# EAGLE board GaN_Fet_ESC_V0.1 (EAGLE 9.6.0), part 1 of 2
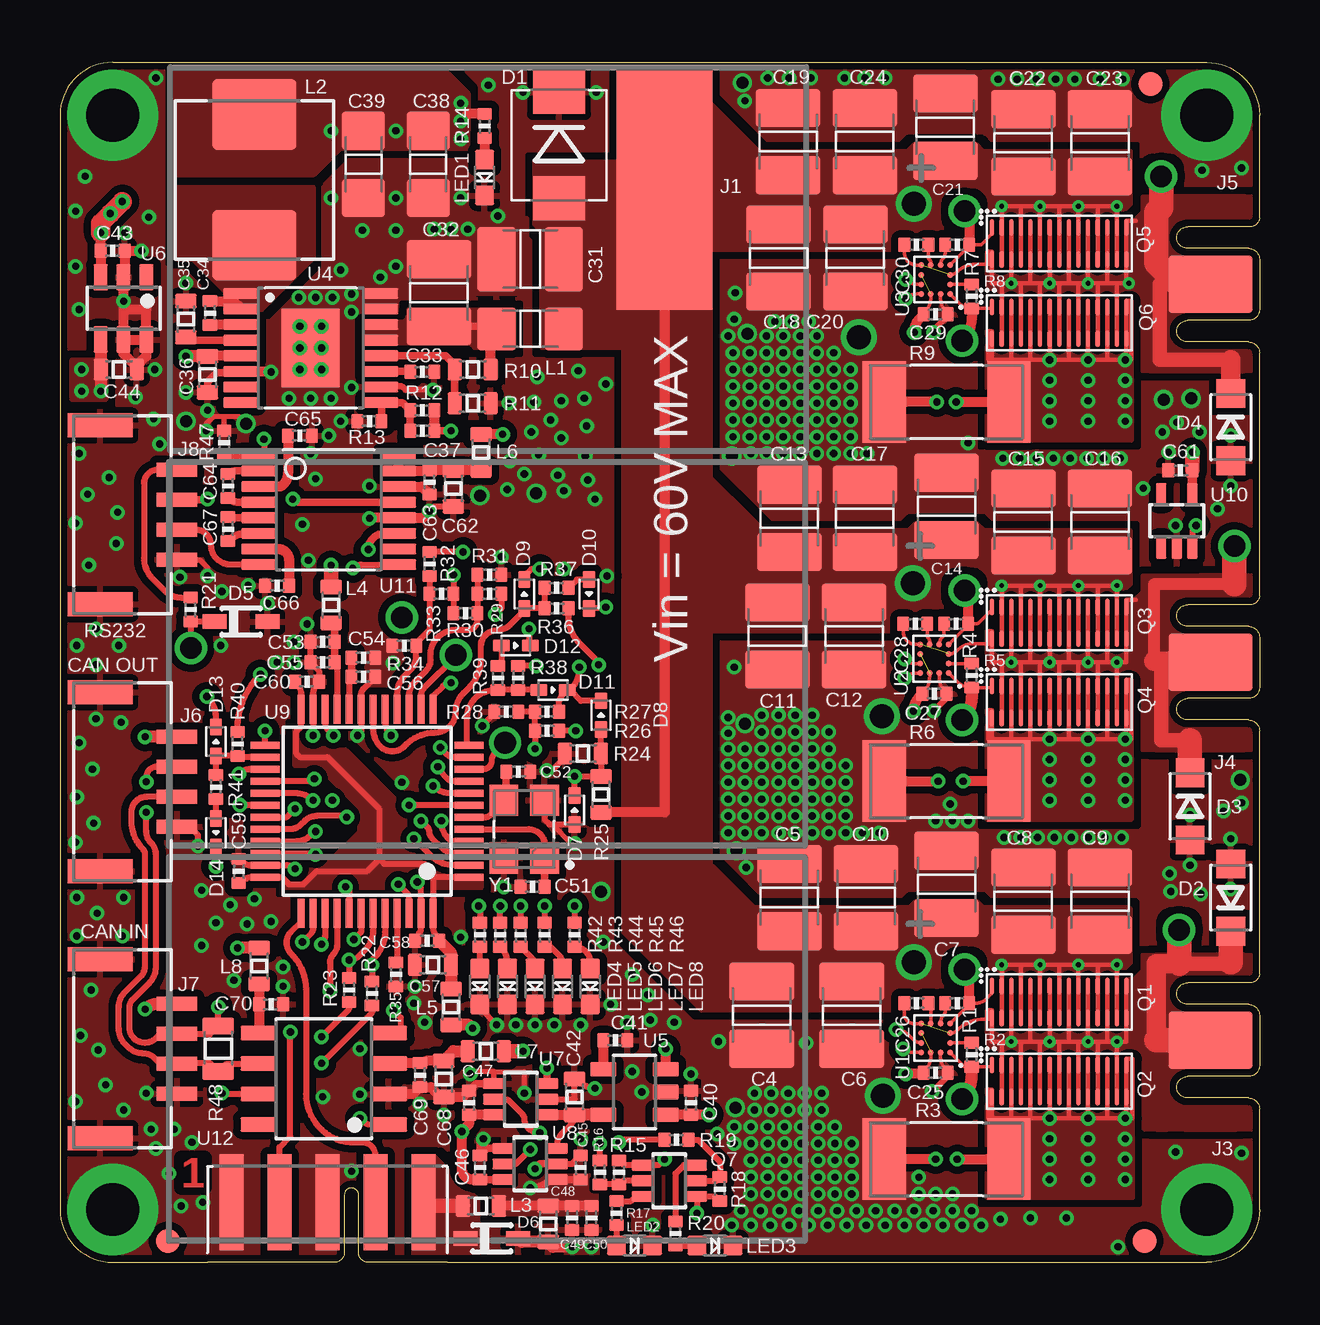
[diagram p2: board, top side]
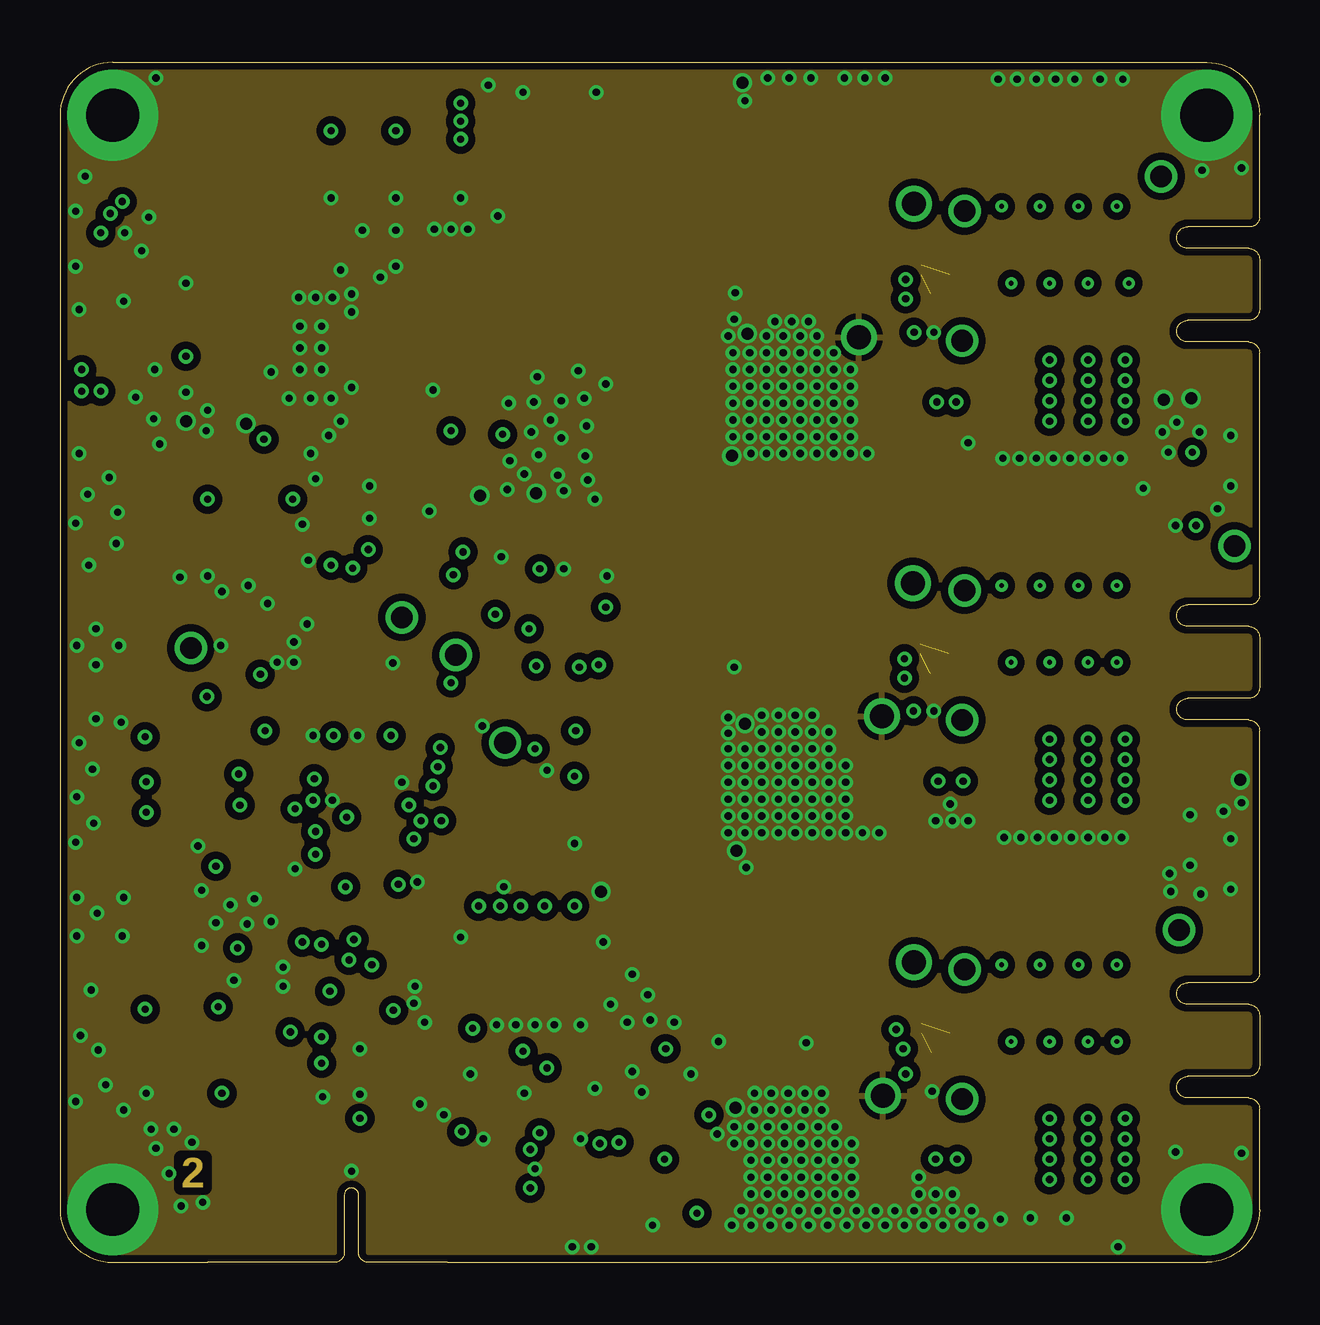
[diagram p3: board, inner layer Route2]
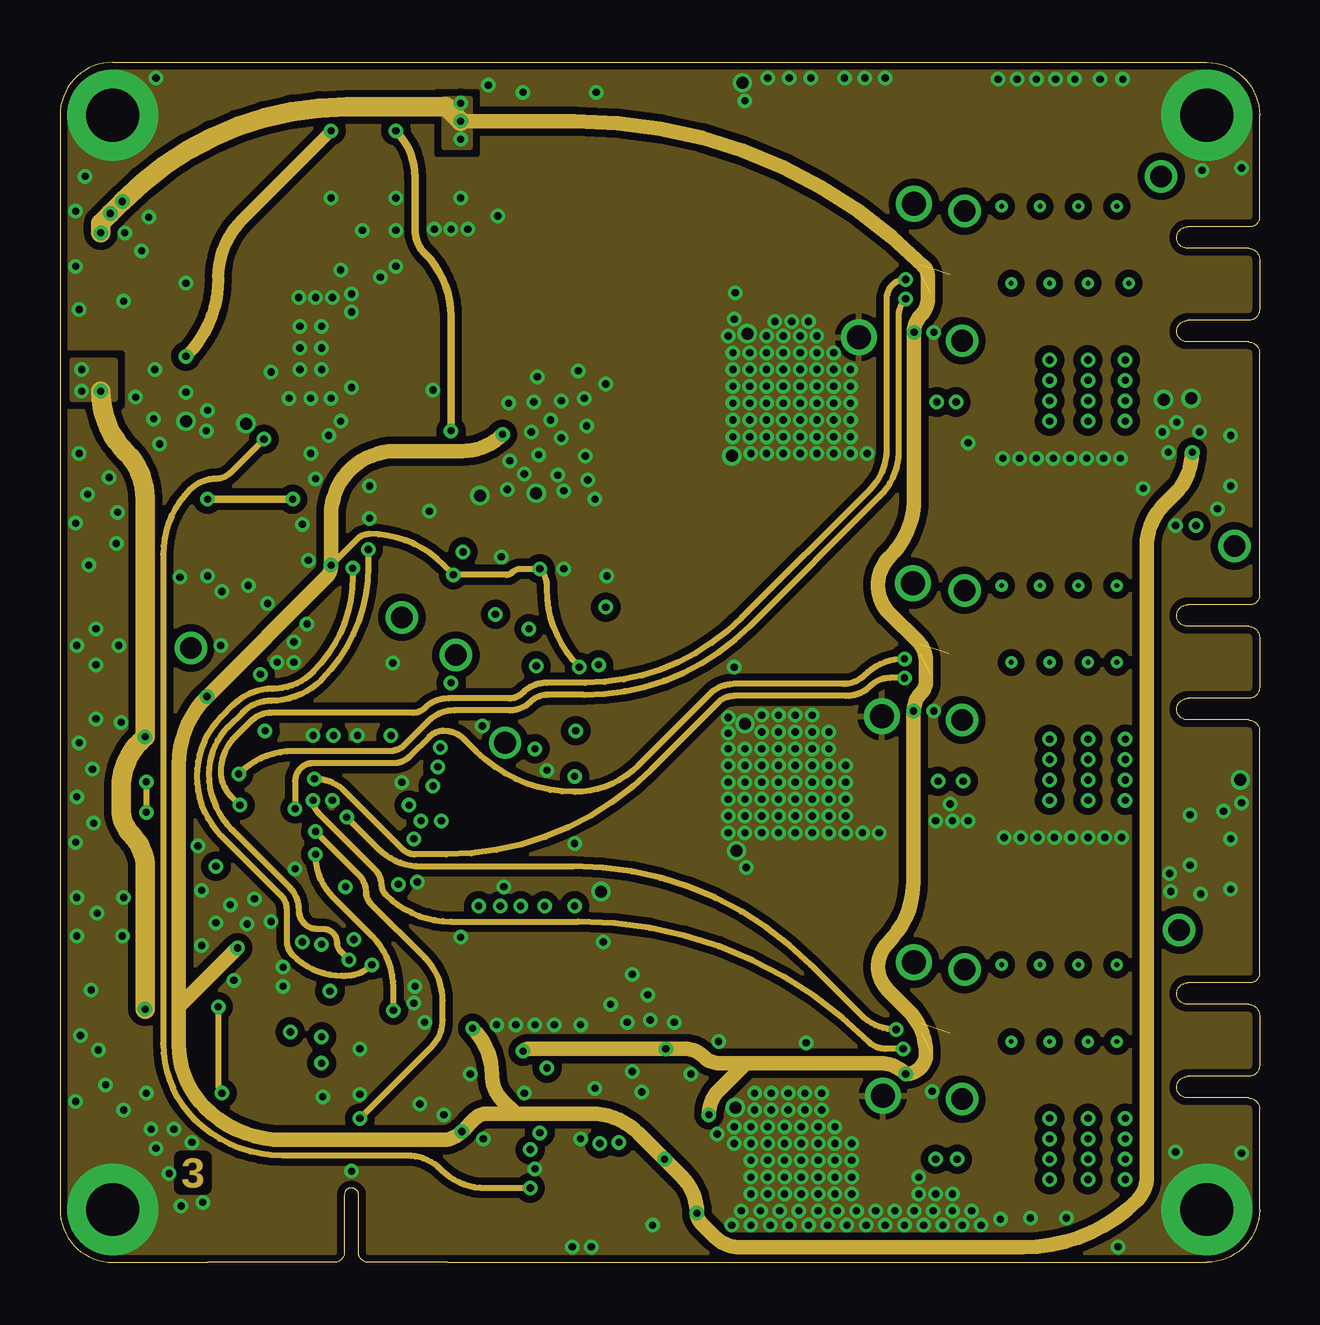
[diagram p4: board, inner layer Route15]
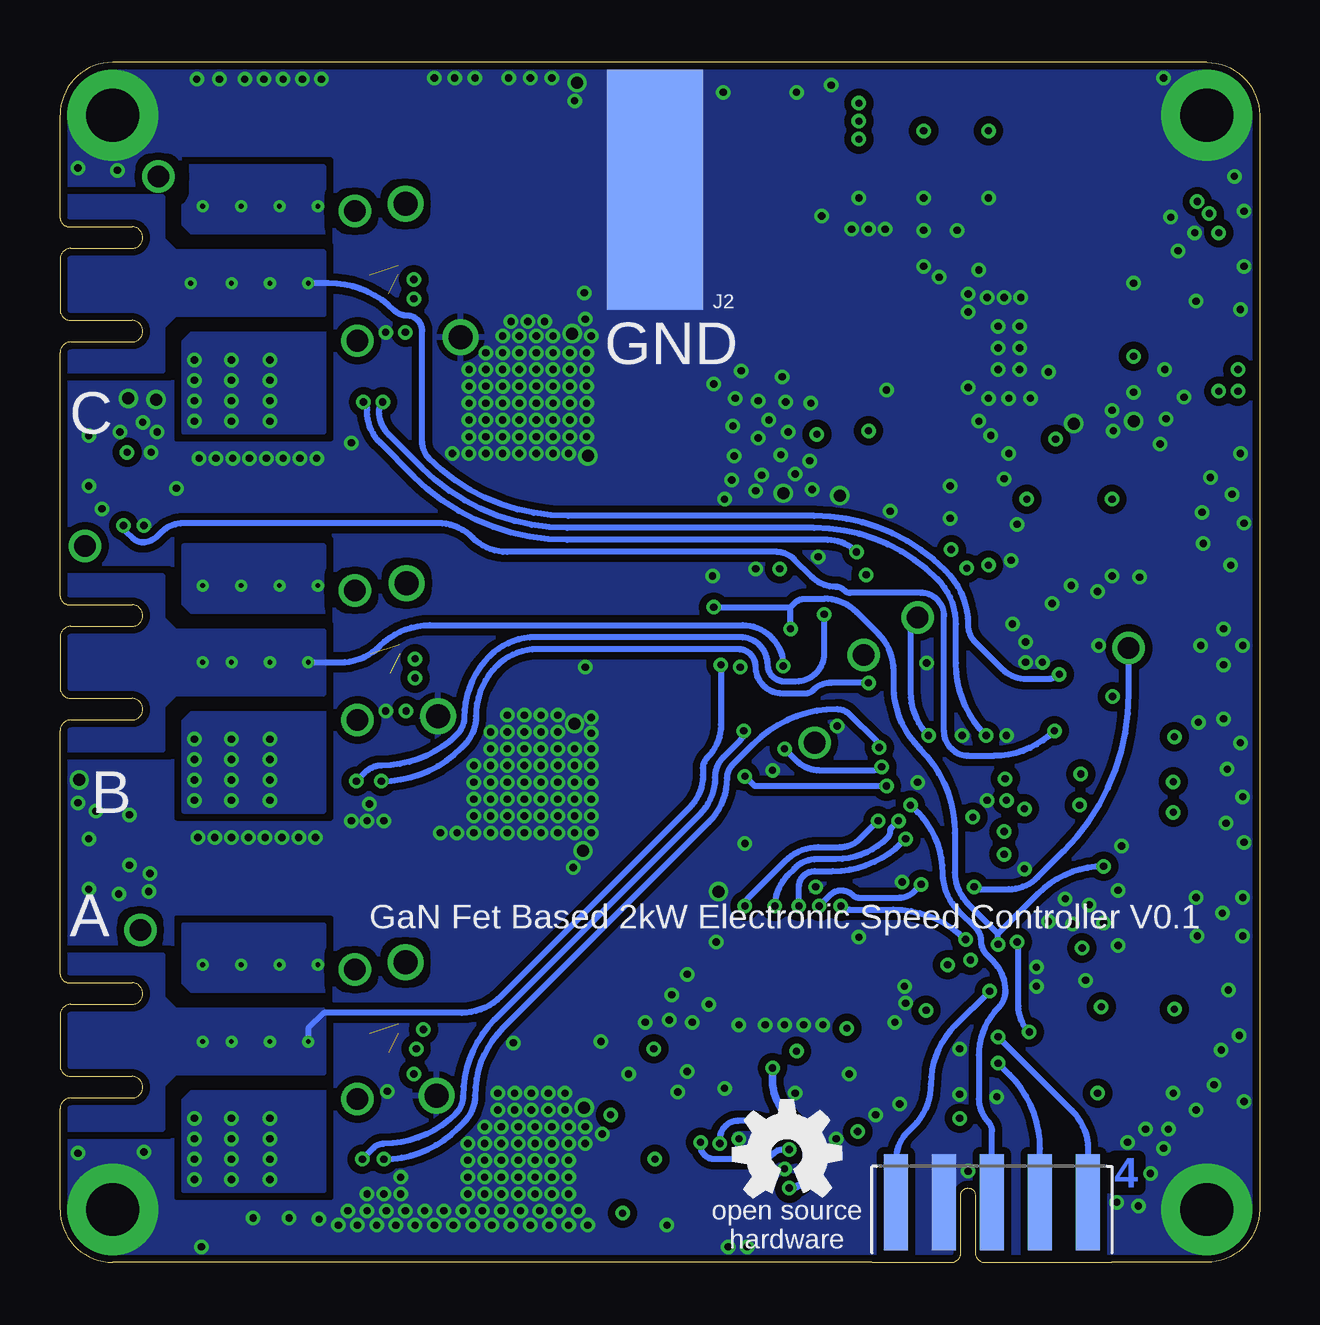
[diagram p5: board, bottom side, seen from below]

Size 50 x 50 mm. Coordinates in mm from the lower left corner, seen from the top.
Outline: 6.15,0 2.2,0 arc-90 0,2.2 0,47.8 arc-90 2.2,50 47.8,50 arc-90 50,47.8 50,43.5
Outline: 16.15,0 47.8,0 arc90 50,2.2 50,6.4
Outline: 50,12 50,22.15
Outline: 50,27.75 50,37.9
Copper layers (1+2*15+16): Top 0.035mm / dielectric 0.3mm / Route2 0.035mm / dielectric 0.15mm / Route15 0.035mm / dielectric 0.3mm / Bottom 0.035mm
Design rules "Design_Rules_10_mils_4_layer": minimum track width 5mil, minimum drill 0.25mm, track to track 5mil, track to pad 0.2mm, pad to pad 0.2mm, via to via 0.18mm, smd to smd 0.2mm, copper to edge 0.3mm, drill to drill 12mil, minimum pad ring 6mil, minimum via ring 6mil, stop-mask expansion 0mil, vias tented up to drill 0.6mm, thermal gap 10mil

## Footprints (pad centres in the part's own frame; a part is rotated, then mirrored left to right if it is on the bottom)
AIM_1_MM = smd 1 x 1: AIM 0,0
C_7.50_16_26.5_1 = drill 1: + -2.5,-2.3; - -0.2,3.25
C_7.50_16_26.5_2 = drill 1: + -2.5,-2.95; - -1.2,2.6
C_7.50_16_26.5_3 = drill 1: + -2.55,-3.6; - -1.25,1.95
C1210 = smd 1.6 x 2.7: 1 -1.4,0; 2 1.4,0
C0402 = smd 0.5 x 0.6: 1 -0.5,0; 2 0.5,0
C0603 = smd 0.6 x 0.9: 1 -0.75,0; 2 0.75,0
C1206 = smd 1.6 x 1.8: 1 -1.4,0; 2 1.4,0
DO214AA(SMB) = smd 1.82 x 2.18: A 2.21,0; K -2.21,0
SOD123F = smd 1.2 x 1.2: A 1.4,0; C -1.4,0
SOD323F = smd 1 x 0.6: A 1.1,0; C -1.1,0
SOD523 = smd 0.7 x 0.5: A 0.6,0; C -0.6,0
4X10SMD = smd 4 x 10: 1 0,0
POLYMAX_3.5MM = smd 3.5 x 2.4: 1 0,0
JST_SM04B-GHS-TB = smd 0.6 x 1.7: 1 -1.875,2.275; 2 -0.625,2.275; 3 0.625,2.275; 4 1.875,2.275 | smd 1 x 2.7: 5 -3.725,-0.925; 6 3.725,-0.925
009159010061916 = smd 1 x 4: 1 -4,-2.5; 2 -2,-2.5; 3 0,-2.5; 4 2,-2.5; 5 4,-2.5 | smd 1 x 4 bottom: 6 -4,-2.5; 7 -2,-2.5; 8 0,-2.5; 9 2,-2.5; 10 4,-2.5
L1206 = smd 1.6 x 1.8: 1 -1.4,0; 2 1.4,0
WURTH_6.6X6.6 = smd 2.95 x 3.5: 1 -2.725,0; 2 2.725,0
L0603 = smd 0.6 x 0.9: 1 -0.75,0; 2 0.75,0
CHIP-LED0603 = smd 0.8 x 0.8: A 0,-0.75; C 0,0.75
EPC2206 = smd 0.18 x 0.7: 1 -2.8,0.665; 2 -2.8,-0.665; 3 -2.4,0.665; 4 -2.4,-0.665; 5 -2,0.665; 6 -2,-0.665; 7 -1.6,0.665; 8 -1.6,-0.665; 9 -1.2,0.665; 10 -1.2,-0.665; 11 -0.8,0.665; 12 -0.8,-0.665; 13 -0.4,0.665; 14 -0.4,-0.665; 15 0,0.665; 16 0,-0.665; 17 0.4,0.665; 18 0.4,-0.665; 19 0.8,0.665; 20 0.8,-0.665; 21 1.2,0.665; 22 1.2,-0.665; 23 1.6,0.665; 24 1.6,-0.665; 25 2,0.665; 26 2,-0.665; 27 2.4,0.665; 28 2.4,-0.665; 29 2.8,0.665; 30 2.8,-0.665
SC-70-6 = smd 0.45 x 0.95: 1 0.65,1.1; 2 0,1.1; 3 -0.65,1.1; 4 -0.65,-1.1; 5 0,-1.1; 6 0.65,-1.1
R0402 = smd 0.5 x 0.6: 1 -0.5,0; 2 0.5,0
CSS2H-2512 = smd 1.8 x 3.4: 1 -2.6,0; 2 2.6,0 | smd 0 x 0: 1_SENSE -1.7,0; 2_SENSE 1.7,0
R0603 = smd 0.6 x 0.9: 1 -0.75,0; 2 0.75,0
R0805 = smd 0.7 x 1.3: 1 -0.95,0; 2 0.95,0
0.9MM = drill 0.9: P$1 0,0
0.5MM = drill 0.5: P$1 0,0
LMG1205 = smd 0.24 x 0.24: 1A -0.6,-0.6; 1B -0.2,-0.6; 1C 0.2,-0.6; 1D 0.6,-0.6; 2A -0.6,-0.2; 2D 0.6,-0.2; 3A -0.6,0.2; 3D 0.6,0.2; 4A -0.6,0.6; 4B -0.2,0.6; 4C 0.2,0.6; 4D 0.6,0.6
TSS0P16-PAD = smd 0.45 x 1.5: 1 -2.275,-2.9; 2 -1.625,-2.9; 3 -0.975,-2.9; 4 -0.325,-2.9; 5 0.325,-2.9; 6 0.975,-2.9; 7 1.625,-2.9; 8 2.275,-2.9; 9 2.275,2.9; 10 1.625,2.9; 11 0.975,2.9; 12 0.325,2.9; 13 -0.325,2.9; 14 -0.975,2.9; 15 -1.625,2.9; 16 -2.275,2.9 | smd 3.29 x 2.41: PAD 0,0
SOT-23-5 = smd 1.1 x 0.6: 1 -1.3,0.95; 2 -1.3,0; 3 -1.3,-0.95; 4 1.3,-0.95; 5 1.3,0.95
SOT-23-6 = smd 1.1 x 0.6: 1 -1.3,0.95; 2 -1.3,0; 3 -1.3,-0.95; 4 1.3,-0.95; 5 1.3,0; 6 1.3,0.95
LQFP-48 = smd 0.3 x 1.2: 1 -2.75,-4.25; 2 -2.25,-4.25; 3 -1.75,-4.25; 4 -1.25,-4.25; 5 -0.75,-4.25; 6 -0.25,-4.25; 7 0.25,-4.25; 8 0.75,-4.25; 9 1.25,-4.25; 10 1.75,-4.25; 11 2.25,-4.25; 12 2.75,-4.25; 25 2.75,4.25; 26 2.25,4.25; 27 1.75,4.25; 28 1.25,4.25; 29 0.75,4.25; 30 0.25,4.25; 31 -0.25,4.25; 32 -0.75,4.25; 33 -1.25,4.25; 34 -1.75,4.25; 35 -2.25,4.25; 36 -2.75,4.25 | smd 1.2 x 0.3: 13 4.25,-2.75; 14 4.25,-2.25; 15 4.25,-1.75; 16 4.25,-1.25; 17 4.25,-0.75; 18 4.25,-0.25; 19 4.25,0.25; 20 4.25,0.75; 21 4.25,1.25; 22 4.25,1.75; 23 4.25,2.25; 24 4.25,2.75; 37 -4.25,2.75; 38 -4.25,2.25; 39 -4.25,1.75; 40 -4.25,1.25; 41 -4.25,0.75; 42 -4.25,0.25; 43 -4.25,-0.25; 44 -4.25,-0.75; 45 -4.25,-1.25; 46 -4.25,-1.75; 47 -4.25,-2.25; 48 -4.25,-2.75
SC-70-5 = smd 0.45 x 0.95: 1 0.65,1.1; 2 0,1.1; 3 -0.65,1.1; 4 -0.65,-1.1; 5 0.65,-1.1
TSS0P16 = smd 0.45 x 1.5: 1 -2.275,-2.9; 2 -1.625,-2.9; 3 -0.975,-2.9; 4 -0.325,-2.9; 5 0.325,-2.9; 6 0.975,-2.9; 7 1.625,-2.9; 8 2.275,-2.9; 9 2.275,2.9; 10 1.625,2.9; 11 0.975,2.9; 12 0.325,2.9; 13 -0.325,2.9; 14 -0.975,2.9; 15 -1.625,2.9; 16 -2.275,2.9
SOIC-8 = smd 1.55 x 0.6: 1 -2.7,1.905; 2 -2.7,0.635; 3 -2.7,-0.635; 4 -2.7,-1.905; 5 2.7,-1.905; 6 2.7,-0.635; 7 2.7,0.635; 8 2.7,1.905
CRYSTAL_SMD_3.2X2.5MM = smd 1.3 x 1.2: 1 -1.2,-0.85; 2 1.2,-0.85; 3 1.2,0.85; 4 -1.2,0.85

## Placement (x,y rotation side)
AIM1  [AIM_1_MM]  45.2,0.9 0 top
AIM2  [AIM_1_MM]  45.45,49.1 0 top
AIM3  [AIM_1_MM]  4.5,0.9 0 top
C1  680uF 80V  [C_7.50_16_26.5_1]  33.1,41.8 180 top
C2  680uF 80V  [C_7.50_16_26.5_2]  33.05,25.35 180 top
C3  680uF 80V  [C_7.50_16_26.5_3]  33.05,8.9 180 top
C4  4.7uF 100V  [C1210]  29.25,10.3 270 top
C5  4.7uF 100V  [C1210]  30.4,15.2 90 top
C6  4.7uF 100V  [C1210]  33,10.3 270 top
C7  4.7uF 100V  [C1210]  36.95,15.75 90 top
C8  4.7uF 100V  [C1210]  40.15,15.05 90 top
C9  4.7uF 100V  [C1210]  43.35,15.05 90 top
C10  4.7uF 100V  [C1210]  33.6,15.2 90 top
C11  4.7uF 100V  [C1210]  29.9,26.1 270 top
C12  4.7uF 100V  [C1210]  33.1,26.1 270 top
C13  4.7uF 100V  [C1210]  30.4,31 90 top
C14  4.7uF 100V  [C1210]  36.95,31.5 90 top
C15  4.7uF 100V  [C1210]  40.15,30.85 90 top
C16  4.7uF 100V  [C1210]  43.35,30.85 90 top
C17  4.7uF 100V  [C1210]  33.55,31 90 top
C18  4.7uF 100V  [C1210]  29.95,41.85 270 top
C19  4.7uF 100V  [C1210]  30.35,46.7 90 top
C20  4.7uF 100V  [C1210]  33.15,41.85 270 top
C21  4.7uF 100V  [C1210]  36.9,47.3 90 top
C22  4.7uF 100V  [C1210]  40.15,46.65 90 top
C23  4.7uF 100V  [C1210]  43.35,46.65 90 top
C24  4.7uF 100V  [C1210]  33.55,46.7 90 top
C25  1uF 10V  [C0402]  36.5,7.9 0 top
C26  0.1uF 25V  [C0402]  35.7,10.8 180 top
C27  1uF 10V  [C0402]  36.45,23.7 0 top
C28  0.1uF 25V  [C0402]  35.65,26.6 180 top
C29  1uF 10V  [C0402]  36.5,39.5 0 top
C30  0.1uF 25V  [C0402]  35.7,42.4 180 top
C31  4.7uF 100V  [C1210]  19.6,41.8 180 top
C32  4.7uF 100V  [C1210]  15.8,40.4 90 top
C33  22nF 10V  [C0402]  15.1,37.1 0 top
C34  10uF 10V  [C0603]  5.25,39.3 90 top
C35  1uF 10V  [C0402]  6.25,39.55 270 top
C36  10uF 10V  [C0603]  6.15,37 270 top
C37  47pF C0G  [C0402]  15.1,34.65 180 top
C38  47uF 10V  [C1206]  15.35,45.75 270 top
C39  47uF 10V  [C1206]  12.65,45.75 270 top
C40  1uF 10V  [C0402]  26.3,6.65 90 top
C41  10nF 6.3V  [C0402]  23.15,9.25 0 top
C42  10uF 10V  [C0603]  21.45,6.9 90 top
C43  0.1uF 25V  [C0402]  2.2,42.15 0 top
C44  10uF 10V  [C0603]  2.45,37.2 0 top
C45  1uF 10V  [C0402]  21.7,3.95 90 top
C46  1uF 10V  [C0402]  17.5,3.95 90 top
C47  1uF 10V  [C0402]  17.05,6.65 90 top
C48  10uF 10V  [C0603]  20.35,1.6 270 top
C49  1uF 10V  [C0402]  21.35,1.85 270 top
C50  0.1uF 25V  [C0402]  22.15,1.85 270 top
C51  18pF C0G  [C0402]  19.7,15.65 0 top
C52  18pF C0G  [C0402]  19.1,20.45 180 top
C53  1uF 10V  [C0402]  10.95,25.85 180 top
C54  1uF 10V  [C0402]  12.65,25.2 0 top
C55  10nF 6.3V  [C0402]  10.95,25 180 top
C56  0.1uF 25V  [C0402]  12.65,24.4 0 top
C57  10uF 10V  [C0603]  15.55,12.4 180 top
C58  0.1uF 25V  [C0402]  15.3,13.4 180 top
C59  0.1uF 25V  [C0402]  7.45,16.3 90 top
C60  0.1uF 25V  [C0402]  10.3,24.2 0 top
C61  0.1uF 25V  [C0402]  46.7,33 180 top
C62  10uF 10V  [C0603]  16.4,32.25 270 top
C63  0.1uF 25V  [C0402]  15.4,32.5 270 top
C64  0.1uF 25V  [C0402]  7,32.35 270 top
C65  0.1uF 25V  [C0402]  10,34.45 0 top
C66  0.1uF 25V  [C0402]  9.05,28.2 180 top
C67  0.1uF 25V  [C0402]  7,30.55 270 top
C68  10uF 10V  [C0603]  16,7.65 270 top
C69  0.1uF 25V  [C0402]  15,7.8 270 top
C70  0.1uF 25V  [C0402]  8.8,10.75 0 top
D1  SMBJ60CA  [DO214AA(SMB)]  20.8,46.55 270 top
D2  PMEG10010ELR  [SOD123F]  48.8,15.2 90 top
D3  PMEG10010ELR  [SOD123F]  47.1,19 270 top
D4  PMEG10010ELR  [SOD123F]  48.8,34.8 270 top
D5  MM3Z3V3  [SOD323F]  7.55,26.7 0 top
D6  PESD3V3U1UA  [SOD323F]  18,1 0 top
D7  BAS16  [SOD523]  21.45,18.85 270 top
D8  BAS16  [SOD523]  22.55,22.8 270 top
D9  BAS16  [SOD523]  19.35,27.85 270 top
D10  BAT54  [SOD523]  22.05,27.85 90 top
D11  BAS16  [SOD523]  20.55,23.85 180 top
D12  BAT54  [SOD523]  19,25.7 180 top
D13  BAS16  [SOD523]  6.5,21.7 270 top
D14  BAT54  [SOD523]  6.5,17.9 90 top
J1  [4X10SMD]  25.2,44.7 180 top
J2  [4X10SMD]  25.2,44.7 0 bottom
J3  POLYMAX_3.5MM  [POLYMAX_3.5MM]  47.95,9.25 0 top
J4  POLYMAX_3.5MM  [POLYMAX_3.5MM]  47.95,25 0 top
J5  POLYMAX_3.5MM  [POLYMAX_3.5MM]  47.95,40.75 0 top
J6  JST_SM04B-GHS-TB  [JST_SM04B-GHS-TB]  2.6,20.02 270 top
J7  JST_SM04B-GHS-TB  [JST_SM04B-GHS-TB]  2.6,8.9 270 top
J8  JST_SM04B-GHS-TB  [JST_SM04B-GHS-TB]  2.6,31.15 270 top
J9  009159010061916  [009159010061916]  11.15,0 180 top
L1  120R  [L1206]  19.6,38.9 180 top
L2  15uH 2.75A  [WURTH_6.6X6.6]  8.1,45.1 90 top
L3  470R  [L0603]  17.55,2.35 180 top
L4  470R  [L0603]  11.3,27.4 270 top
L5  470R  [L0603]  16.3,10.65 270 top
L6  470R  [L0603]  17.55,33.75 270 top
L7  470R  [L0603]  17.75,8.8 180 top
L8  470R  [L0603]  8.3,12.35 90 top
LED1  green  [CHIP-LED0603]  17.7,45.2 180 top
LED2  green  [CHIP-LED0603]  23.95,0.7 270 top
LED3  green  [CHIP-LED0603]  27.3,0.7 270 top
LED4  green  [CHIP-LED0603]  17.5,11.5 180 top
LED5  yellow  [CHIP-LED0603]  18.65,11.5 180 top
LED6  white  [CHIP-LED0603]  19.8,11.5 180 top
LED7  blue  [CHIP-LED0603]  20.95,11.5 180 top
LED8  red  [CHIP-LED0603]  22.1,11.5 180 top
Q1  EPC2206  [EPC2206]  41.65,10.85 0 top
Q2  EPC2206  [EPC2206]  41.65,7.55 0 top
Q3  EPC2206  [EPC2206]  41.65,26.65 0 top
Q4  EPC2206  [EPC2206]  41.65,23.35 0 top
Q5  EPC2206  [EPC2206]  41.65,42.45 0 top
Q6  EPC2206  [EPC2206]  41.65,39.15 0 top
Q7  BSD223P  [SC-70-6]  25.4,3.4 90 top
R1  0R  [R0402]  37.4,10.8 0 top
R2  0R  [R0402]  38,8.65 270 top
R3  2m  [CSS2H-2512]  36.95,4.3 180 top
R4  0R  [R0402]  37.35,26.6 0 top
R5  0R  [R0402]  38,24.45 270 top
R6  2m  [CSS2H-2512]  36.95,20.05 180 top
R7  0R  [R0402]  37.4,42.4 0 top
R8  0R  [R0402]  38,40.25 270 top
R9  2m  [CSS2H-2512]  36.95,35.85 180 top
R10  1M  [R0603]  17.2,37.2 0 top
R11  61.9k  [R0603]  17.2,35.8 180 top
R12  1M  [R0402]  15.1,35.5 0 top
R13  249k  [R0402]  12.9,35.05 0 top
R14  10k  [R0402]  17.7,47.35 90 top
R15  10k  [R0402]  23.3,3.75 90 top
R16  100R  [R0402]  22.5,3.75 270 top
R17  3.3k  [R0402]  23.2,2.05 90 top
R18  10k  [R0402]  27.5,3.05 270 top
R19  100R  [R0402]  25.7,5.1 0 top
R20  3.3k  [R0402]  25.65,1.2 90 top
R21  1k  [R0402]  5.44,27.21 90 top
R22  51R  [R0402]  13,11.2 270 top
R23  51R  [R0402]  12.05,11.35 270 top
R24  1.3k  [R0603]  21.8,21.2 0 top
R25  30.9k  [R0603]  22.55,19.5 270 top
R26  1.96k  [R0402]  20.3,22.15 180 top
R27  30.9k  [R0402]  20.3,22.95 0 top
R28  2.1k  [R0402]  18.6,22.95 0 top
R29  1.96k  [R0402]  17.9,27.85 180 top
R30  30.9k  [R0402]  16.9,27.05 180 top
R31  2.1k  [R0402]  17.9,28.65 180 top
R32  1.96k  [R0402]  15.4,29.1 270 top
R33  30.9k  [R0402]  15.9,27.85 0 top
R34  2.1k  [R0402]  14.35,25.7 0 top
R35  10k  [R0402]  14,12 90 top
R36  10k  [R0402]  20.7,27.25 180 top
R37  2.1k  [R0402]  20.7,28.1 0 top
R38  10k  [R0402]  19.1,24.35 270 top
R39  2.1k  [R0402]  18.25,24.35 90 top
R40  10k  [R0402]  7.4,21.6 270 top
R41  2.1k  [R0402]  6.5,19.8 270 top
R42  3.3k  [R0402]  17.5,13.65 90 top
R43  3.3k  [R0402]  18.35,13.65 90 top
R44  1k  [R0402]  19.2,13.65 90 top
R45  1k  [R0402]  20.2,13.65 90 top
R46  3.3k  [R0402]  21.45,13.65 90 top
R47  100k  [R0402]  6.85,34.15 270 top
R48  120R  [R0805]  6.6,8.9 90 top
TP1  [0.9MM]  37.7,12.2 90 top
TP2  [0.9MM]  37.6,6.8 90 top
TP3  [0.9MM]  37.7,28 90 top
TP4  [0.9MM]  37.6,22.6 90 top
TP5  [0.9MM]  37.7,43.8 90 top
TP6  [0.9MM]  37.6,38.4 90 top
TP7  [0.5MM]  28.45,49.15 90 top
TP8  [0.5MM]  28.65,38.7 90 top
TP9  [0.5MM]  46,35.95 0 top
TP10  [0.5MM]  28,33.6 90 top
TP11  [0.5MM]  28.55,22.45 90 top
TP12  [0.5MM]  47.15,36 90 top
TP13  [0.9MM]  46.65,13.85 180 top
TP14  [0.9MM]  48.95,29.85 90 top
TP15  [0.9MM]  45.9,45.25 90 top
TP16  [0.5MM]  28.2,17.15 90 top
TP17  [0.5MM]  28.15,6.45 90 top
TP18  [0.5MM]  22.55,15.45 90 top
TP19  [0.9MM]  14.25,26.88 90 top
TP20  [0.9MM]  18.55,21.65 90 top
TP21  [0.9MM]  16.5,25.3 90 top
TP22  [0.5MM]  17.5,31.95 90 top
TP23  [0.5MM]  7.75,34.95 90 top
TP24  [0.5MM]  49.2,20.1 90 top
TP26  [0.5MM]  5.25,35.05 90 top
TP36  [0.5MM]  19.85,32.05 90 top
TP39  [0.9MM]  5.45,25.6 90 top
U1  LMG1205  [LMG1205]  36.5,9.35 90 top
U2  LMG1205  [LMG1205]  36.45,25.15 90 top
U3  LMG1205  [LMG1205]  36.5,40.95 90 top
U4  LM46002  [TSS0P16-PAD]  10.45,38.1 270 top
U5  LP2985A-3.3  [SOT-23-5]  23.95,7.1 180 top
U6  TPD3S014  [SOT-23-6]  2.65,39.75 270 top
U7  LM66100  [SC-70-6]  19.2,6.8 270 top
U8  LM66100  [SC-70-6]  19.6,4.1 270 top
U9  STM32G473CET6  [LQFP-48]  12.8,18.8 90 top
U10  MCP9700A  [SC-70-5]  46.55,30.9 180 top
U11  MAX3221  [TSS0P16]  11.2,31.35 270 top
U12  TCAN1051V  [SOIC-8]  11,7.65 180 top
U$1  LOGO  [LOGO]  19.7,4.5 0 bottom
Y1  8Mhz  [CRYSTAL_SMD_3.2X2.5MM]  19.35,18.05 90 top